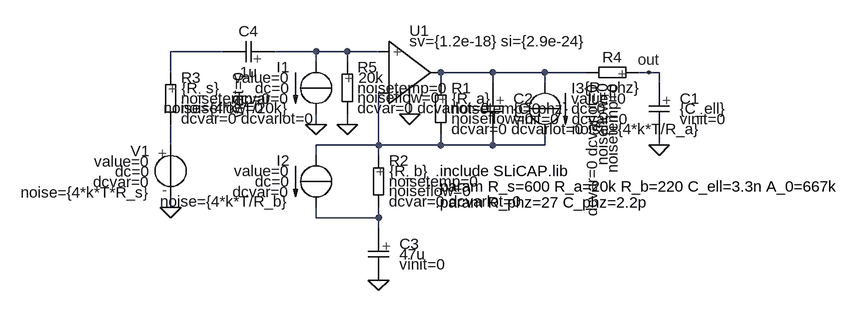
[diagram p0: schematic myFirstVampOPA211completeNoise.asc]
myFirstVampOPA211completeNoise.asc, the LTspice schematic file:
Version 4
SHEET 1 880 680
WIRE -80 112 -160 112
WIRE 64 112 0 112
WIRE 112 112 64 112
WIRE 160 112 112 112
WIRE 64 128 64 112
WIRE 112 128 112 112
WIRE -160 144 -160 112
WIRE 336 144 256 144
WIRE 416 144 336 144
WIRE 480 144 416 144
WIRE 576 144 560 144
WIRE 592 144 576 144
WIRE 256 160 256 144
WIRE 336 160 336 144
WIRE 416 160 416 144
WIRE 592 160 592 144
WIRE 208 208 208 192
WIRE 64 224 64 208
WIRE 112 224 112 208
WIRE -160 256 -160 224
WIRE 160 256 160 176
WIRE 160 256 64 256
WIRE 256 256 256 240
WIRE 256 256 160 256
WIRE 336 256 336 240
WIRE 336 256 256 256
WIRE 416 256 416 240
WIRE 416 256 336 256
WIRE 592 256 592 240
WIRE 64 272 64 256
WIRE 160 272 160 256
WIRE -160 352 -160 336
WIRE 64 368 64 352
WIRE 160 368 160 352
WIRE 160 368 64 368
WIRE 160 384 160 368
FLAG 208 208 0
FLAG 592 256 0
FLAG -160 352 0
FLAG 576 144 out
FLAG 112 224 0
FLAG 160 464 0
FLAG 64 224 0
SYMBOL SLR 256 160 R0
SYMATTR InstName R1
SYMATTR Value {R_a}
SYMBOL SLR 160 272 R0
SYMATTR InstName R2
SYMATTR Value {R_b}
SYMBOL SLR -160 144 R0
SYMATTR InstName R3
SYMATTR Value {R_s}
SYMBOL SLV -160 256 M0
SYMATTR InstName V1
SYMATTR SpiceLine2 noise={4*k*T*R_s}
SYMBOL SLC 592 160 R0
SYMATTR InstName C1
SYMATTR Value {C_ell}
SYMBOL SLR 560 144 R90
WINDOW 0 -8 40 VBottom 2
WINDOW 3 8 40 VTop 2
SYMATTR InstName R4
SYMATTR Value {R_phz}
SYMBOL SLC 336 160 R0
SYMATTR InstName C2
SYMATTR Value {C_phz}
SYMBOL SLC 160 384 R0
SYMATTR InstName C3
SYMATTR Value 47u
SYMBOL SLC 0 112 R90
WINDOW 0 -16 40 VBottom 2
WINDOW 3 16 40 VTop 2
SYMATTR InstName C4
SYMATTR Value 1u
SYMBOL SLR 112 128 R0
SYMATTR InstName R5
SYMATTR Value 20k
SYMBOL SLO_noise 176 144 R0
SYMATTR InstName U1
SYMATTR Value sv={1.2e-18} si={2.9e-24}
SYMBOL SLI 64 128 M0
SYMATTR InstName I1
SYMATTR SpiceLine2 noise={4*k*T/20k}
SYMBOL SLI 64 272 M0
SYMATTR InstName I2
SYMATTR SpiceLine2 noise={4*k*T/R_b}
SYMBOL SLI 416 160 R0
SYMATTR InstName I3
SYMATTR SpiceLine2 noise={4*k*T/R_a}
TEXT 248 296 Left 2 !.include SLiCAP.lib
TEXT 248 320 Left 2 !.param R_s=600 R_a=20k R_b=220 C_ell=3.3n A_0=667k
TEXT 248 344 Left 2 !.param R_phz=27 C_phz=2.2p

The netlist it stands for:
* myFirstVampOPA211completeNoise.asc
R1 N003 N005 R {R_a} noisetemp=0 noiseflow=0 dcvar=0 dcvarlot=0
R2 N005 N006 R {R_b} noisetemp=0 noiseflow=0 dcvar=0 dcvarlot=0
R3 N001 N004 R {R_s} noisetemp=0 noiseflow=0 dcvar=0 dcvarlot=0
V1 N004 0 V value=0 dc=0 dcvar=0 noise={4*k*T*R_s}
C1 out 0 C {C_ell} vinit=0
R4 out N003 R {R_phz} noisetemp=0 noiseflow=0 dcvar=0 dcvarlot=0
C2 N003 N005 C {C_phz} vinit=0
C3 N006 0 C 47u vinit=0
C4 N002 N001 C 1u vinit=0
R5 N002 0 R 20k noisetemp=0 noiseflow=0 dcvar=0 dcvarlot=0
XU1 N002 N005 N003 0 O_noise sv={1.2e-18} si={2.9e-24}  ; pins NC+ NC- + -
I1 N002 0 I value=0 dc=0 dcvar=0 noise={4*k*T/20k}
I2 N005 N006 I value=0 dc=0 dcvar=0 noise={4*k*T/R_b}
I3 N003 N005 I value=0 dc=0 dcvar=0 noise={4*k*T/R_a}
.include SLiCAP.lib
.param R_s=600 R_a=20k R_b=220 C_ell=3.3n A_0=667k
.param R_phz=27 C_phz=2.2p
.backanno
.end